# Altium schematic sheet eBox_3G_REG.schdoc: car_logger_fona_reg
size A4; DocumentNumber: 3; SheetNumber: 3; SheetTotal: 3
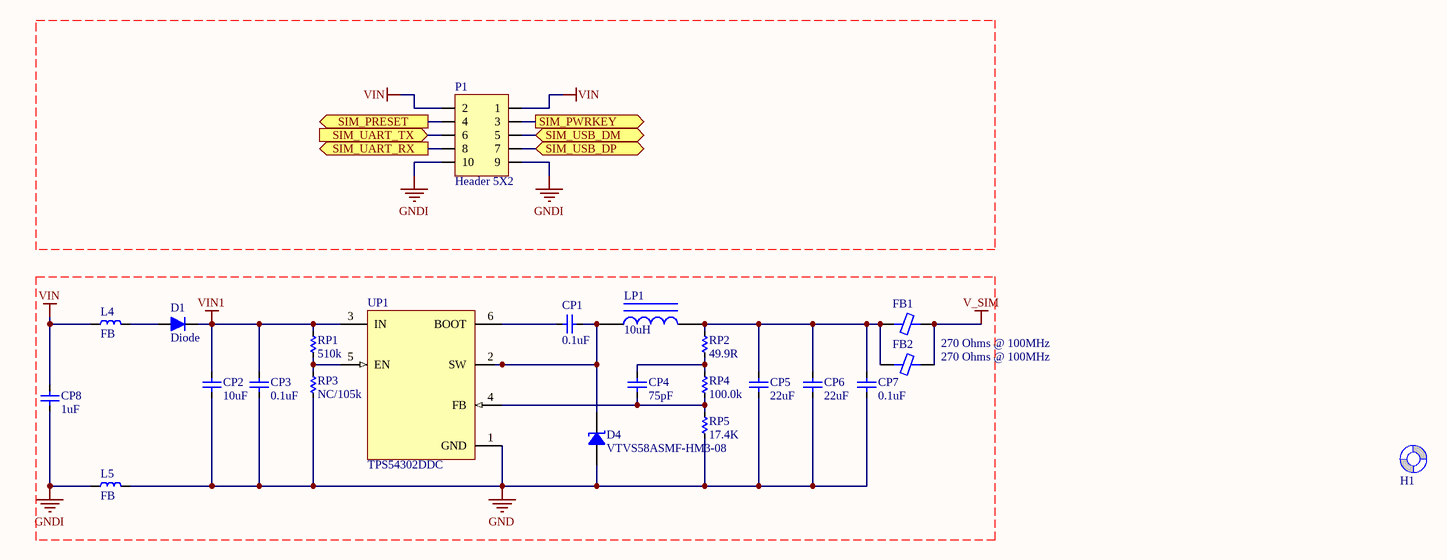
[diagram p0: eBox_3G_REG.schdoc]

## Parts
CP1  0.1uF  [CC 0603]
CP2  10uF  [CC 0805]
CP3  0.1uF  [CC 0603]
CP4  75pF  [CC 0603]
CP5  22uF  [CC 0805]
CP6  22uF  [CC 0805]
CP7  0.1uF  [CC 0603]
CP8  1uF  [CC 0805]
D1  Diode  [DO-214AC (SMA) L]
D4  VTVS58ASMF-HM3-08  [SMF DO-219AB]
FB1  270 Ohms @ 100MHz  [L 0805 (2012)]
FB2  270 Ohms @ 100MHz  [L 0805 (2012)]
H1  Screw Hole  [SCREW/2.8M/5M]  (value not drawn)  (no BOM)
L4  FB  [L 0805 (2012)]
L5  FB  [L 0805 (2012)]
LP1  10uH  [IND_MWSA0518_525418]
P1  Header 5X2  [HDR/Header/10/DL]
RP1  510k  [RR 0603]
RP2  49.9R  [RR 0603]
RP3  NC/105k  [RR 0603]
RP4  100.0k  [RR 0603]
RP5  17.4K  [RR 0603]
UP1  TPS54302DDC  [SOT-23-6]

## Ports
SIM_PRESET (out), SIM_PWRKEY (out), SIM_UART_RX (out), SIM_UART_TX (in), SIM_USB_DM, SIM_USB_DP

## Nets
GND: CP2.2 CP3.2 CP5.2 CP6.2 CP7.2 D4.1 L5.2 RP3.1 RP5.2 UP1.1(GND)
GNDI: CP8.2 L5.1 P1.9 P1.10
V_SIM: FB1.2 FB2.2
VIN: CP8.1 L4.1 P1.1 P1.2
VIN1: CP2.1 CP3.1 D1.2(K) RP1.2 UP1.3(IN)
SIM_PRESET: P1.4 ; port SIM_PRESET
SIM_PWRKEY: P1.3 ; port SIM_PWRKEY
SIM_UART_RX: P1.8 ; port SIM_UART_RX
SIM_UART_TX: P1.6 ; port SIM_UART_TX
SIM_USB_DM: P1.5 ; port SIM_USB_DM
SIM_USB_DP: P1.7 ; port SIM_USB_DP
NetCP1_1: CP1.1 UP1.6(BOOT)
NetCP1_2: CP1.2 D4.2 LP1.1 UP1.2(SW)
NetCP4_1: CP4.1 RP2.2 RP4.1
NetCP4_2: CP4.2 RP4.2 RP5.1 UP1.4(FB)
NetCP5_1: CP5.1 CP6.1 CP7.1 FB1.1 FB2.1 LP1.2 RP2.1
NetD1_1: D1.1(A) L4.2
NetRP1_1: RP1.1 RP3.2 UP1.5(EN)

Not connected (* = marked no-connect by the designer): H1 1(Screw)

## Notes on the sheet
- Title
- Size:
- Date:
- A4
- Number:
- Time:
- Revision:
- Sheet
- of
- NPN
- Lab
- File:

## Library data of the parts
CP1 CP3 CP7 = Capacitor NP: CAP CER 0.1UF 16V X7R 0603; Manufacturer: Murata Electronics; Manufacturer Part Number: GCJ188R71C104KA01D; Supplier 1: Digi-Key; Supplier Part Number 1: 490-5796-2-ND; Termination Style: SMD/SMT; Package: 0603 (1608 Metric)
CP2 = Capacitor NP: CAP CER 10UF 25V X5R 0805; Manufacturer: Murata Electronics; Manufacturer Part Number: GRM21BR61E106MA73L; Supplier 1: Digi-Key; Supplier Part Number 1: 490-10748-2-ND; Termination Style: SMD/SMT; Package: 0805 (2012 Metric)
CP4 = Capacitor NP: CAP CER 75PF 50V C0G/NP0 0603; Manufacturer: Murata Electronics; Manufacturer Part Number: GRM1885C1H750JA01D; Supplier 1: Digi-Key; Supplier Part Number 1: 490-1424-1-ND; Termination Style: SMD/SMT; Package: 0603 (1608 Metric)
CP5 CP6 CP8 = Capacitor NP: CAP CER 22UF 25V X5R 0805; Manufacturer: Murata Electronics; Manufacturer Part Number: GRM21BR61E226ME44L; Supplier 1: Digi-Key; Supplier Part Number 1: 490-10749-2-ND; Termination Style: SMD/SMT; Package: 0805 (2012 Metric)
D1 = Diode: Default Diode
D4 = VTVS58ASMF-HM3-08: TVS DIODE 57.6V 98V DO219AB; Manufacturer: Vishay Semiconductor Diodes Division; Capacitance @ Frequency: 245pF @ 1MHz; Current - Peak Pulse (10/1000µs): 3.89A; Power Line Protection: No; Power - Peak Pulse: 400W; Type: DO-219AB; Unidirectional Channels: 1; Voltage - Breakdown (Min): 64.6V; Part Number: VTVS58ASMF-HM3-08; Applications: Automotive; ComponentLink1Description: Datasheet; ComponentLink1URL: http://www.vishay.com/docs/85891/vtvs3v3asmf.pdf; ComponentLink2Description: DigiKey Link; ComponentLink2URL: http://digikey.com/product-detail/en/vishay-semiconductor-diodes-division/VTVS58ASMF-HM3-08/112-VTVS58ASMF-HM3-08CT-ND/11562600; Device Package: DO-219AB; LastUpdated: 3/21/2020 12:56:09 AM; Lifecycle Status: Active; Minimum Order: 0; Mounting Type: Surface Mount; Operating Temperature: -55°C ~ 175°C (TJ); Package / Case: DO-219AB; Packaging: TapeAndReel; PartId: 5476; Part Status: -55°C ~ 175°C (TJ); Price: 0.10; Series: Automotive, AEC-Q101, TransZorb®; Supplier 1: DigiKey; Supplier Part Number 1: 112-VTVS58ASMF-HM3-08CT-ND; Supplier Device Package: DO-219AB (SMF); Voltage - Clamping (Max) @ Ipp: 98V; Voltage - Reverse Standoff (Typ): 57.6V
FB1 FB2 = BLM21PG300SZ1D: FERRITE BEAD 30 OHM 0805 1LN; Manufacturer: Murata Electronics; Current Rating (Max): 4A; DC Resistance (DCR) (Max): 14mOhm; Filter Type: Power Line; Impedance @ Frequency: 30 Ohms @ 100MHz; Number of Lines: 1; Part Number: BLM21PG300SZ1D; ComponentLink1Description: Datasheet; ComponentLink1URL: https://www.murata.com/en-us/products/en-us/products/productdata/8796749987870/QNFA9114.pdf; ComponentLink2Description: DigiKey Link; ComponentLink2URL: http://digikey.com/product-detail/en/murata-electronics/BLM21PG300SZ1D/490-16662-1-ND/7595584; Device Package: 0805 (2012 Metric); Height (Max): 0.041" (1.05mm); LastUpdated: 1/21/2020 2:29:28 AM; Lifecycle Status: Active; Minimum Order: 1; Mounting Type: Surface Mount; Operating Temperature: -55°C ~ 125°C; Package / Case: 0805 (2012 Metric); Packaging: TapeAndReel; PartId: 1190; Part Status: Active; Price: 0.03; Ratings: AEC-Q200; Series: BLM; Size / Dimension: 0.079" L x 0.049" W (2.00mm x 1.25mm); Supplier 1: DigiKey; Supplier Part Number 1: 490-16662-1-ND; Value: 270 Ohms @ 100MHz
L4 L5 = Inductor
LP1 = Inductor Power: Fixed Inductors 10uH 20% Low Profile; Manufacturer: Sunlord; Manufacturer Part Number: MWSA0518-100MT; Termination Style: SMD/SMT; Package: 5254
P1 = Header 5X2: Header, 5-Pin, Dual row
RP1 = Resistors: RES SMD 510K OHM 1% 1/10W 0603; Manufacturer: Panasonic Industrial Devices; Manufacturer Part Number: ERJ-3EKF5103V; Supplier 1: Digi-Key; Supplier Part Number 1: P510KHCT-ND; Termination Style: SMD/SMT; Package: 0603 (1608 Metric)
RP2 = Resistors: RES SMD 49.9 OHM 1% 1/10W 0603; Manufacturer: Panasonic Industrial Devices; Manufacturer Part Number: ERJ-3EKF49R9V; Supplier 1: Digi-Key; Supplier Part Number 1: P49.9HTR-ND; Termination Style: SMD/SMT; Package: 0603 (1608 Metric)
RP3 = Resistors: RES SMD 105K OHM 1% 1/10W 0603; Manufacturer: Panasonic Industrial Devices; Manufacturer Part Number: ERJ-3EKF1053V; Supplier 1: Digi-Key; Supplier Part Number 1: P105KHCT-ND; Termination Style: SMD/SMT; Package: 0603 (1608 Metric)
RP4 = Resistors: RES SMD 100K OHM 1% 1/10W 0603; Manufacturer: Panasonic Industrial Devices; Manufacturer Part Number: ERJ-3EKF1003V; Supplier 1: Digi-Key; Supplier Part Number 1: P100KHCT-ND; Termination Style: SMD/SMT; Package: 0603 (1608 Metric)
RP5 = Resistors: RES SMD 17.4K OHM 1% 1/10W 0603; Manufacturer: Panasonic Industrial Devices; Manufacturer Part Number: ERJ-3EKF1742V; Supplier 1: Digi-Key; Supplier Part Number 1: P17.4KHTR-ND; Termination Style: SMD/SMT; Package: 0603 (1608 Metric)
UP1 = TPS56339: IC REG BUCK ADJ 3A TSOT23-6; Manufacturer: Texas Instruments; Manufacturer Part Number: TPS54302DDCR; Package: SOT-23-6; Supplier 1: Digi-Key; Supplier Part Number 1: 296-46237-1-ND; Termination Style: SMD/SMT